# Altium schematic sheet ext-memory.SchDoc: DSP External Memory
size A4; SheetNumber: 9; SheetTotal: 17
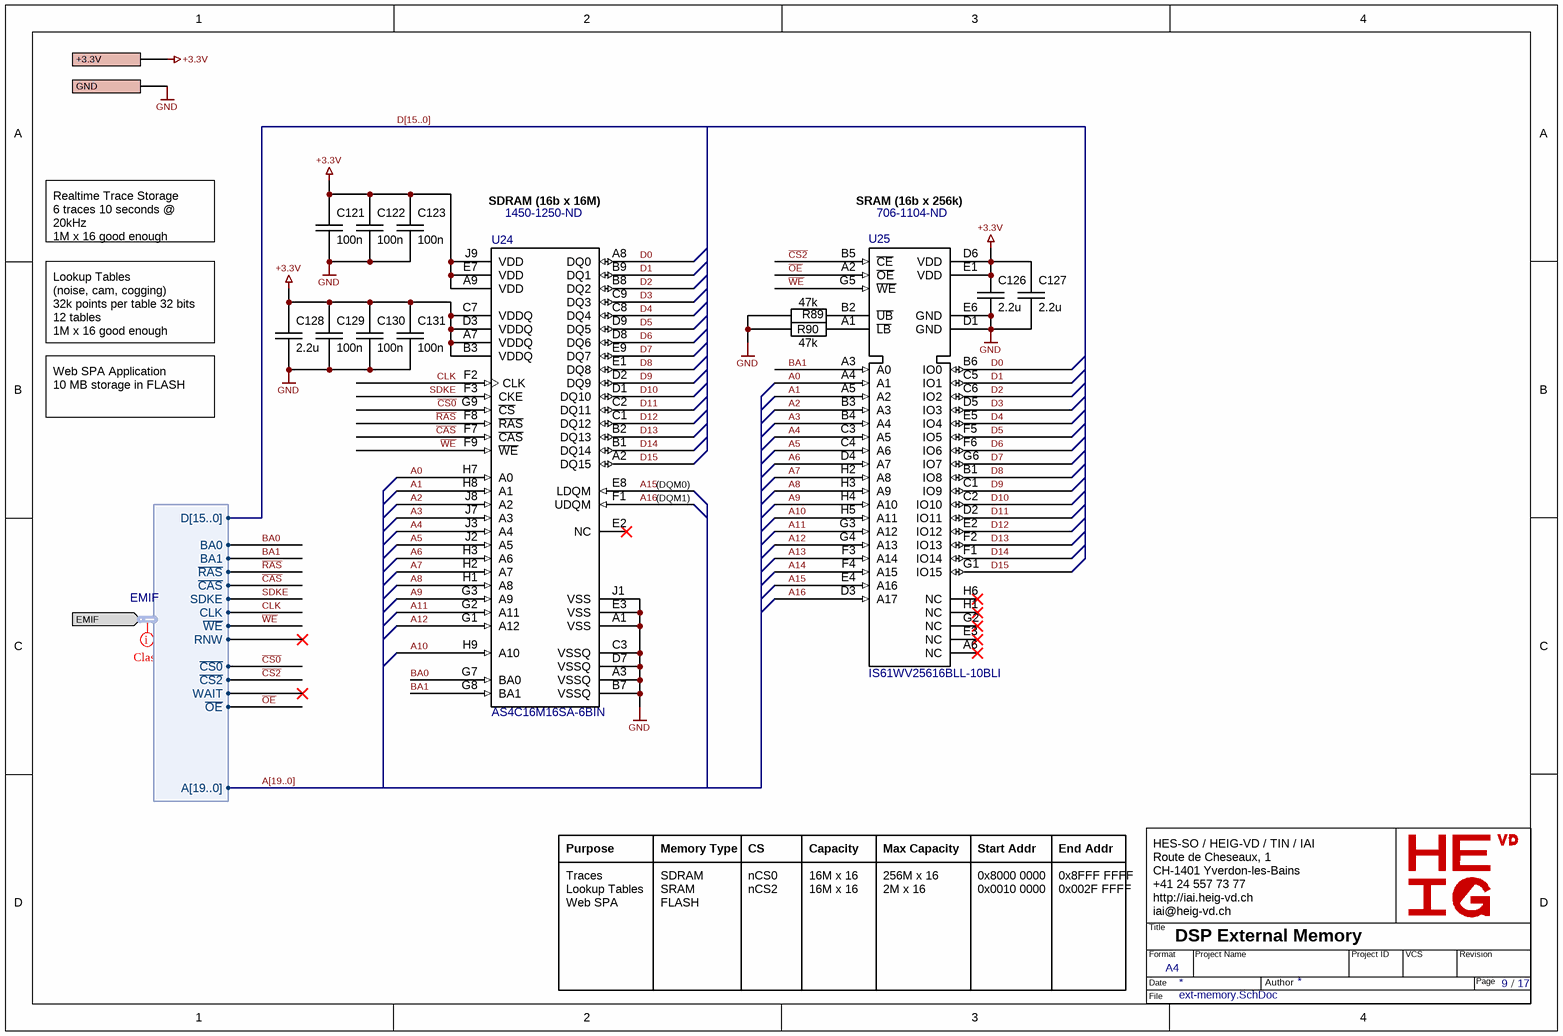
[diagram p0: ext-memory.SchDoc]

## Parts
C121  value 100n  [SM/C0201]  (hidden comment: CL05A104KP5NNNC)
C122  value 100n  [SM/C0201]  (hidden comment: CL05A104KP5NNNC)
C123  value 100n  [SM/C0201]  (hidden comment: CL05A104KP5NNNC)
C126  value 2.2u  [SM/C0402]  (hidden comment: CL05A225MQ5NNNC)
C127  value 2.2u  [SM/C0402]  (hidden comment: CL05A225MQ5NNNC)
C128  2.2u  [SM/C0402]
C129  value 100n  [SM/C0201]  (hidden comment: CL05A104KP5NNNC)
C130  value 100n  [SM/C0201]  (hidden comment: CL05A104KP5NNNC)
C131  value 100n  [SM/C0201]  (hidden comment: CL05A104KP5NNNC)
R89  47k  [SM/R0402]
R90  47k  [SM/R0402]
U24  AS4C16M16SA-6BIN  Supplier Part Number 1: 1450-1250-ND  [TFBGA-54]
U25  IS61WV25616BLL-10BLI  Supplier Part Number 1: 706-1104-ND  [BGA48C75P8X6_800X600X120N]

## Ports
+3.3V, EMIF (in, harness EMIF), GND

## Harnesses
EMIF: A[19..0], D[15..0], ~{RAS}, ~{CAS}, ~{OE}, SDKE, CLK, ~{CS0}, ~{CS2}, BA0, BA1, ~{WE}, RNW, WAIT

## Nets
+3.3V: C121.1 C122.1 C123.1 C126.1 C127.1 C128.1 C129.1 C130.1 C131.1 U24.A7(VDDQ) U24.A9(VDD) U24.B3(VDDQ) U24.C7(VDDQ) U24.D3(VDDQ) U24.E7(VDD) U24.J9(VDD) U25.D6(VDD) U25.E1(VDD) ; port +3.3V
GND: C121.2 C122.2 C123.2 C126.2 C127.2 C128.2 C129.2 C130.2 C131.2 R89.1 R90.1 U24.A1(VSS) U24.A3(VSSQ) U24.B7(VSSQ) U24.C3(VSSQ) U24.D7(VSSQ) U24.E3(VSS) U24.J1(VSS) U25.D1(GND) U25.E6(GND) ; port GND
A0: U24.H7(A0) U25.A4(A1)
A1: U24.H8(A1) U25.A5(A2)
A2: U24.J8(A2) U25.B3(A3)
A3: U24.J7(A3) U25.B4(A4)
A4: U24.J3(A4) U25.C3(A5)
A5: U24.J2(A5) U25.C4(A6)
A6: U24.H3(A6) U25.D4(A7)
A7: U24.H2(A7) U25.H2(A8)
A8: U24.H1(A8) U25.H3(A9)
A9: U24.G3(A9) U25.H4(A10)
A10: U24.H9(A10) U25.H5(A11)
A11: U24.G2(A11) U25.G3(A12)
A12: U24.G1(A12) U25.G4(A13)
A13: U25.F3(A14)
A14: U25.F4(A15)
A15: U24.E8(LDQM) U25.E4(A16)
A16: U24.F1(UDQM) U25.D3(A17)
BA0: U24.G7(BA0) ; port EMIF.BA0
BA1: U24.G8(BA1) U25.A3(A0) ; port EMIF.BA1
~{CAS}: U24.F7(~{CAS}) ; port EMIF.~{CAS}
~{CS0}: U24.G9(~{CS}) ; port EMIF.~{CS0}
~{CS2}: U25.B5(~{CE}) ; port EMIF.~{CS2}
CLK: U24.F2(CLK) ; port EMIF.CLK
D0: U24.A8(DQ0) U25.B6(IO0)
D1: U24.B9(DQ1) U25.C5(IO1)
D2: U24.B8(DQ2) U25.C6(IO2)
D3: U24.C9(DQ3) U25.D5(IO3)
D4: U24.C8(DQ4) U25.E5(IO4)
D5: U24.D9(DQ5) U25.F5(IO5)
D6: U24.D8(DQ6) U25.F6(IO6)
D7: U24.E9(DQ7) U25.G6(IO7)
D8: U24.E1(DQ8) U25.B1(IO8)
D9: U24.D2(DQ9) U25.C1(IO9)
D10: U24.D1(DQ10) U25.C2(IO10)
D11: U24.C2(DQ11) U25.D2(IO11)
D12: U24.C1(DQ12) U25.E2(IO12)
D13: U24.B2(DQ13) U25.F2(IO13)
D14: U24.B1(DQ14) U25.F1(IO14)
D15: U24.A2(DQ15) U25.G1(IO15)
~{OE}: U25.A2(~{OE}) ; port EMIF.~{OE}
~{RAS}: U24.F8(~{RAS}) ; port EMIF.~{RAS}
SDKE: U24.F3(CKE) ; port EMIF.SDKE
~{WE}: U24.F9(~{WE}) U25.G5(~{WE}) ; port EMIF.~{WE}
NetR89_2: R89.2 U25.B2(~{UB})
NetR90_2: R90.2 U25.A1(~{LB})

Not connected (* = marked no-connect by the designer): U24 E2(NC)*; U25 A6(NC)* E3(NC)* G2(NC)* H1(NC)* H6(NC)*

## Buses and harness runs
bus A[19..0]
bus D[15..0]

## Layout directives
net class EMIF: (no net found under the mark)

## Notes on the sheet
- Realtime Trace Storage
  6 traces 10 seconds @ 20kHz
  1M x 16 good enough
- SDRAM (16b x 16M)
- SRAM (16b x 256k)
- Lookup Tables
  (noise, cam, cogging)
  32k points per table 32 bits
  12 tables
  1M x 16 good enough
- Web SPA Application
  10 MB storage in FLASH
- (DQM0)
- (DQM1)
- Purpose
- Memory Type
- CS
- Capacity
- Max Capacity
- Start Addr
- End Addr
- Traces
- Web SPA
- Lookup Tables
- SDRAM
- SRAM
- FLASH
- nCS0
- nCS2
- 16M x 16
- 256M x 16
- 2M x 16
- 0x8000 0000
- 0x0010 0000
- 0x8FFF FFFF
- 0x002F FFFF
- HES-SO / HEIG-VD / TIN / IAI
  Route de Cheseaux, 1
  CH-1401 Yverdon-les-Bains
  +41 24 557 73 77
  http://iai.heig-vd.ch
  iai@heig-vd.ch
- Title
- Format
- Date
- A4
- Project Name
- Author
- Project ID
- VCS
- Revision
- Page
- /
- File

## Library data of the parts
C121-C123 C129-C131 = C: Chip Capacitor; Voltage: 16V; Dielectric: X7R; Supplier 1: Digi-Key; Supplier Part Number 1: 1276-1022-1-ND
C126 C127 = C: CAP CER 10UF 10V X5R 0805; Voltage: 6.3V; Supplier 1: Digi-Key; Supplier Part Number 1: 1276-1469-1-ND
C128 = C: GRM155R61C225KE11D; Dielectric: X5R; Voltage: 16V; Supplier 1: Digi-Key; Supplier Part Number 1: 490-10695-1-ND
R89 R90 = R: 47 kOhms ±1% 0.063W, 1/16W Chip Resistor 0402 (1005 Metric) Moisture Resistant Thick Film; Value: 47k; Supplier 1: Digi-Key; Supplier Part Number 1: 311-47.0KLRCT-ND
U24 = AS4C16M16SA-6BIN: IC DRAM 256MBIT PARALLEL 54TFBGA / SDRAM Memory IC 256Mb (16M x 16) Parallel 166 MHz 5 ns 54-TFBGA (8x8); Supplier 1: Digi-Key
U25 = IS61WV25616BLL-10BLI: SRAM - Asynchronous Memory IC 4Mb (256K x 16) Parallel 10 ns 48-TFBGA (6x8); Supplier 1: Digi-Key